# EAGLE design uPlaits_SE_Control_Board (EAGLE 9.6.2)
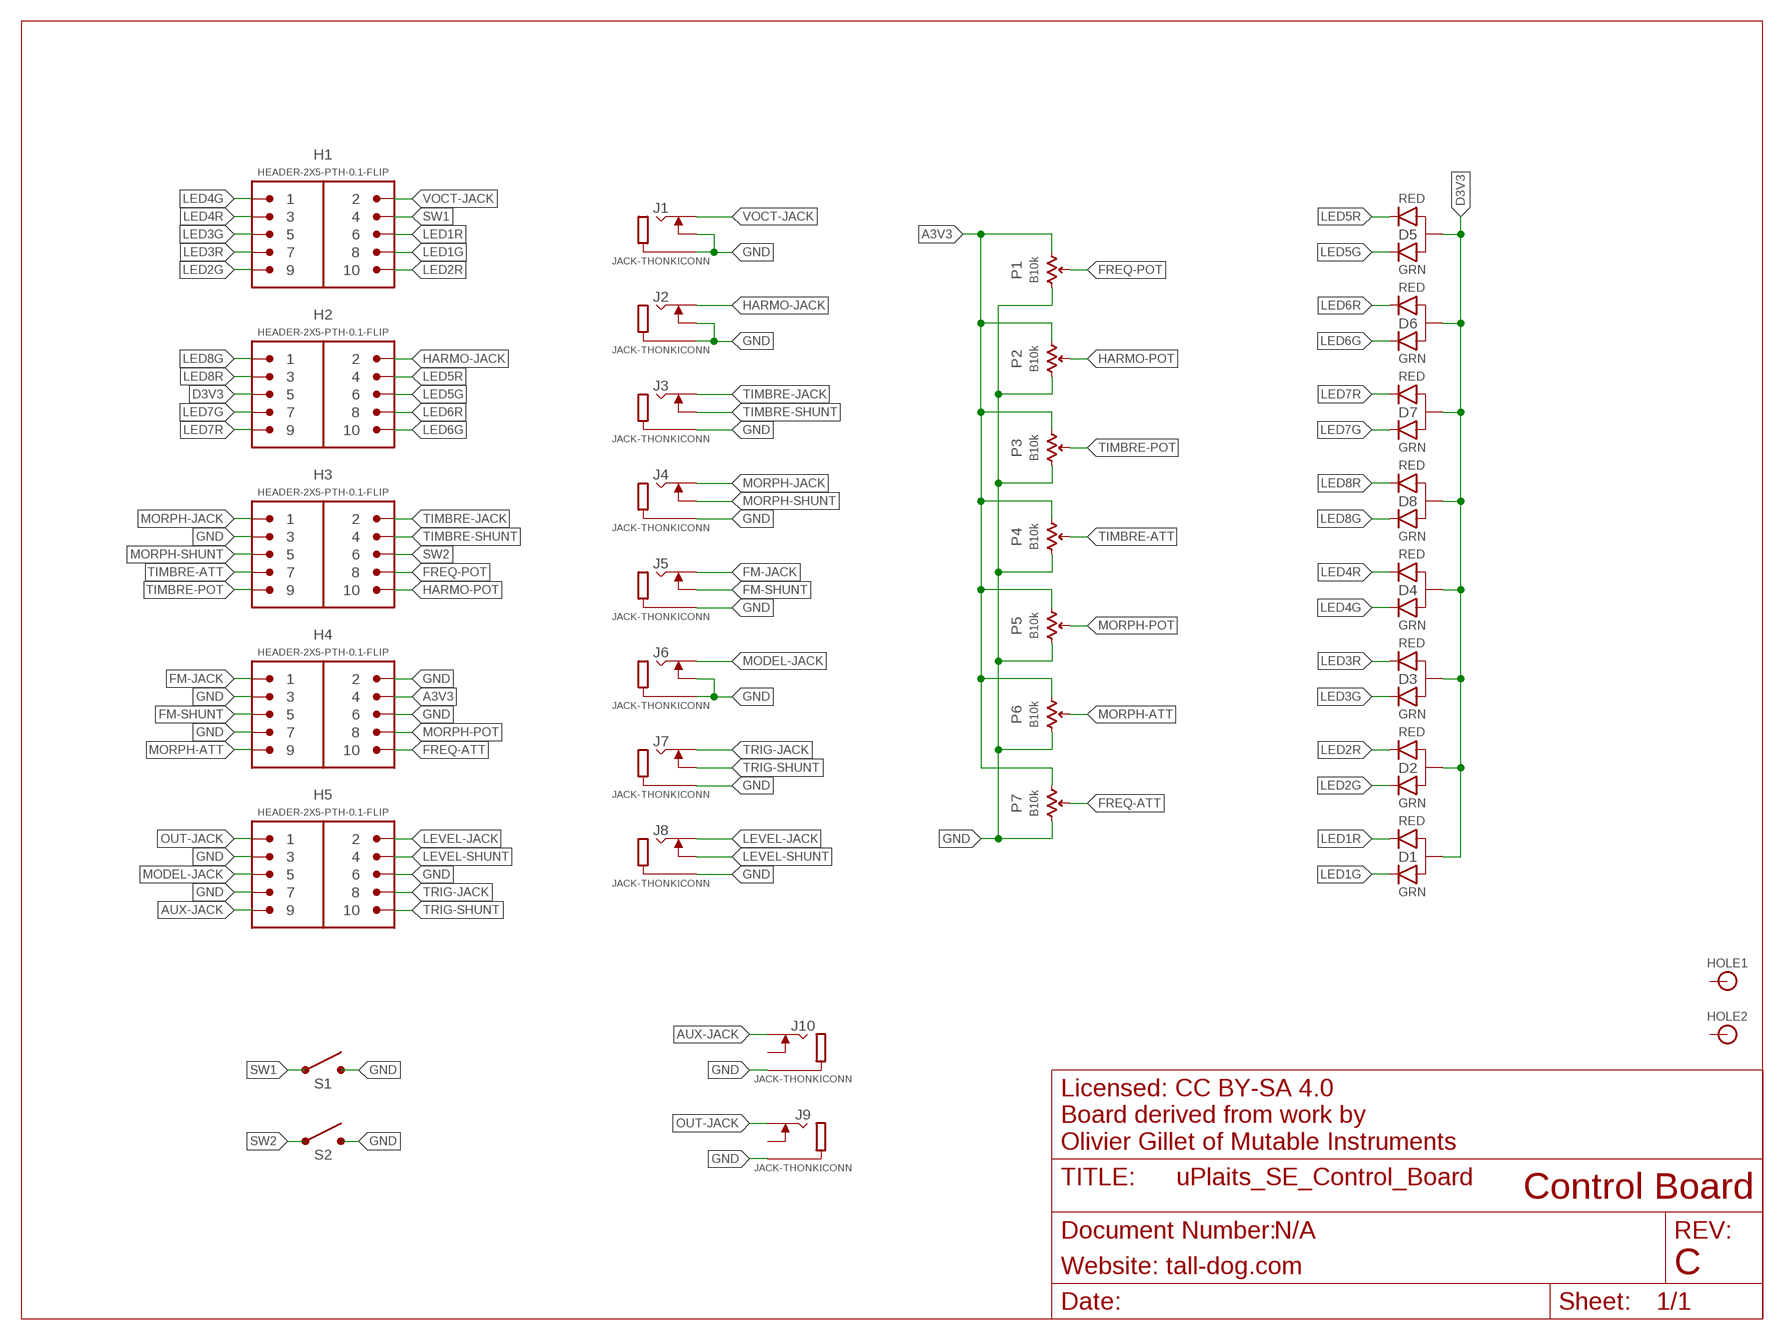
[diagram p0: schematic, sheet 1]

## Parts
D1  LED-DUAL-PTH  [LED-T1-3]
D2  LED-DUAL-PTH  [LED-T1-3]
D3  LED-DUAL-PTH  [LED-T1-3]
D4  LED-DUAL-PTH  [LED-T1-3]
D5  LED-DUAL-PTH  [LED-T1-3]
D6  LED-DUAL-PTH  [LED-T1-3]
D7  LED-DUAL-PTH  [LED-T1-3]
D8  LED-DUAL-PTH  [LED-T1-3]
H1  HEADER-2X5-PTH-0.1-FLIP  [PTH-0.1-2X5-FLIP]
H2  HEADER-2X5-PTH-0.1-FLIP  [PTH-0.1-2X5-FLIP]
H3  HEADER-2X5-PTH-0.1-FLIP  [PTH-0.1-2X5-FLIP]
H4  HEADER-2X5-PTH-0.1-FLIP  [PTH-0.1-2X5-FLIP]
H5  HEADER-2X5-PTH-0.1-FLIP  [PTH-0.1-2X5-FLIP]
HOLE1  HOLE  [HOLE-M2.5]
HOLE2  HOLE  [HOLE-M2.5]
J1  JACK-THONKICONN  [THONKICONN]
J2  JACK-THONKICONN  [THONKICONN]
J3  JACK-THONKICONN  [THONKICONN]
J4  JACK-THONKICONN  [THONKICONN]
J5  JACK-THONKICONN  [THONKICONN]
J6  JACK-THONKICONN  [THONKICONN]
J7  JACK-THONKICONN  [THONKICONN]
J8  JACK-THONKICONN  [THONKICONN]
J9  JACK-THONKICONN  [THONKICONN]
J10  JACK-THONKICONN  [THONKICONN]
P1  B10k  POT-ALPS-VERT-PS  [POT-SONG-9MM]
P2  B10k  POT-ALPS-VERT-PS  [POT-SONG-9MM]
P3  B10k  POT-ALPS-VERT-PS  [POT-SONG-9MM]
P4  B10k  POT-ALPS-VERT-PS  [POT-SONG-9MM]
P5  B10k  POT-ALPS-VERT-PS  [POT-SONG-9MM]
P6  B10k  POT-ALPS-VERT-PS  [POT-SONG-9MM]
P7  B10k  POT-ALPS-VERT-PS  [POT-SONG-9MM]
S1  SPST-PTH  [TL1105]
S2  SPST-PTH  [TL1105]

## Nets
A3V3: H4.4 P1.P$1(E) P2.P$1(E) P3.P$1(E) P4.P$1(E) P5.P$1(E) P6.P$1(E) P7.P$1(E)
AUX-JACK: H5.9 J10.P3
D3V3: D1.2(A) D2.2(A) D3.2(A) D4.2(A) D5.2(A) D6.2(A) D7.2(A) D8.2(A) H2.5
FM-JACK: H4.1 J5.P3
FM-SHUNT: H4.5 J5.P2
FREQ-ATT: H4.10 P7.P$2(S)
FREQ-POT: H3.8 P1.P$2(S)
GND: H3.3 H4.2 H4.3 H4.6 H4.7 H5.3 H5.6 H5.7 J1.P1 J1.P2 J2.P1 J2.P2 J3.P1 J4.P1 J5.P1 J6.P1 J6.P2 J7.P1 J8.P1 J9.P1 J10.P1 P1.P$3(A) P2.P$3(A) P3.P$3(A) P4.P$3(A) P5.P$3(A) P6.P$3(A) P7.P$3(A) S1.3 S1.4 S2.3 S2.4
HARMO-JACK: H2.2 J2.P3
HARMO-POT: H3.10 P2.P$2(S)
LED1G: D1.3(GRN) H1.8
LED1R: D1.1(RED) H1.6
LED2G: D2.3(GRN) H1.9
LED2R: D2.1(RED) H1.10
LED3G: D3.3(GRN) H1.5
LED3R: D3.1(RED) H1.7
LED4G: D4.3(GRN) H1.1
LED4R: D4.1(RED) H1.3
LED5G: D5.3(GRN) H2.6
LED5R: D5.1(RED) H2.4
LED6G: D6.3(GRN) H2.10
LED6R: D6.1(RED) H2.8
LED7G: D7.3(GRN) H2.7
LED7R: D7.1(RED) H2.9
LED8G: D8.3(GRN) H2.1
LED8R: D8.1(RED) H2.3
LEVEL-JACK: H5.2 J8.P3
LEVEL-SHUNT: H5.4 J8.P2
MODEL-JACK: H5.5 J6.P3
MORPH-ATT: H4.9 P6.P$2(S)
MORPH-JACK: H3.1 J4.P3
MORPH-POT: H4.8 P5.P$2(S)
MORPH-SHUNT: H3.5 J4.P2
OUT-JACK: H5.1 J9.P3
SW1: H1.4 S1.1 S1.2
SW2: H3.6 S2.1 S2.2
TIMBRE-ATT: H3.7 P4.P$2(S)
TIMBRE-JACK: H3.2 J3.P3
TIMBRE-POT: H3.9 P3.P$2(S)
TIMBRE-SHUNT: H3.4 J3.P2
TRIG-JACK: H5.8 J7.P3
TRIG-SHUNT: H5.10 J7.P2
VOCT-JACK: H1.2 J1.P3
Unconnected: HOLE1.P$1 HOLE1.P$2 HOLE1.P$3 HOLE1.P$4 HOLE1.P$5 HOLE1.P$6 HOLE1.P$7 HOLE1.P$8 HOLE1.P$9 HOLE2.P$1 HOLE2.P$2 HOLE2.P$3 HOLE2.P$4 HOLE2.P$5 HOLE2.P$6 HOLE2.P$7 HOLE2.P$8 HOLE2.P$9 J9.P2 J10.P2

## Notes on the sheet
- Licensed: CC BY-SA 4.0
  Board derived from work by
  Olivier Gillet of Mutable Instruments
- Control Board
- N/A
- Website: tall-dog.com | C

## Library data of the parts
D1-D8 = uPlaits_SE_Library:LED-DUAL
H1-H5 = uPlaits_SE_Library:HEADER-2X5
HOLE1 HOLE2 = uPlaits_SE_Library:HOLE
J1-J10 = uPlaits_SE_Library:JACK
P1-P7 = uPlaits_SE_Library:POT
S1 S2 = uPlaits_SE_Library:SPST

## Board
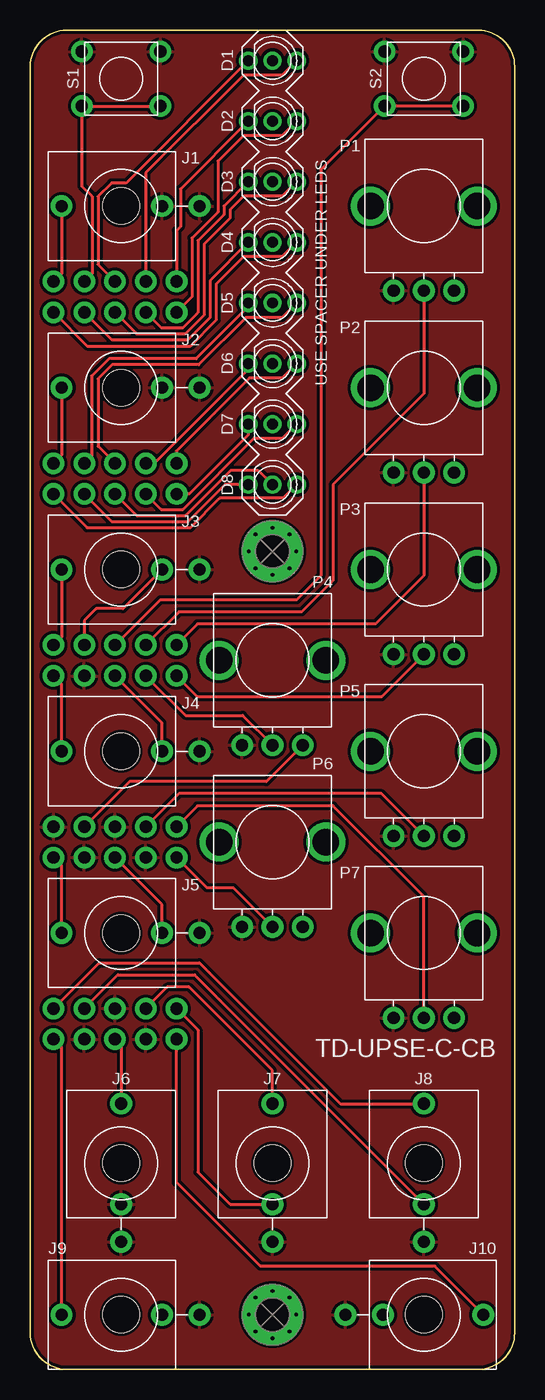
[diagram p1: board, top side]
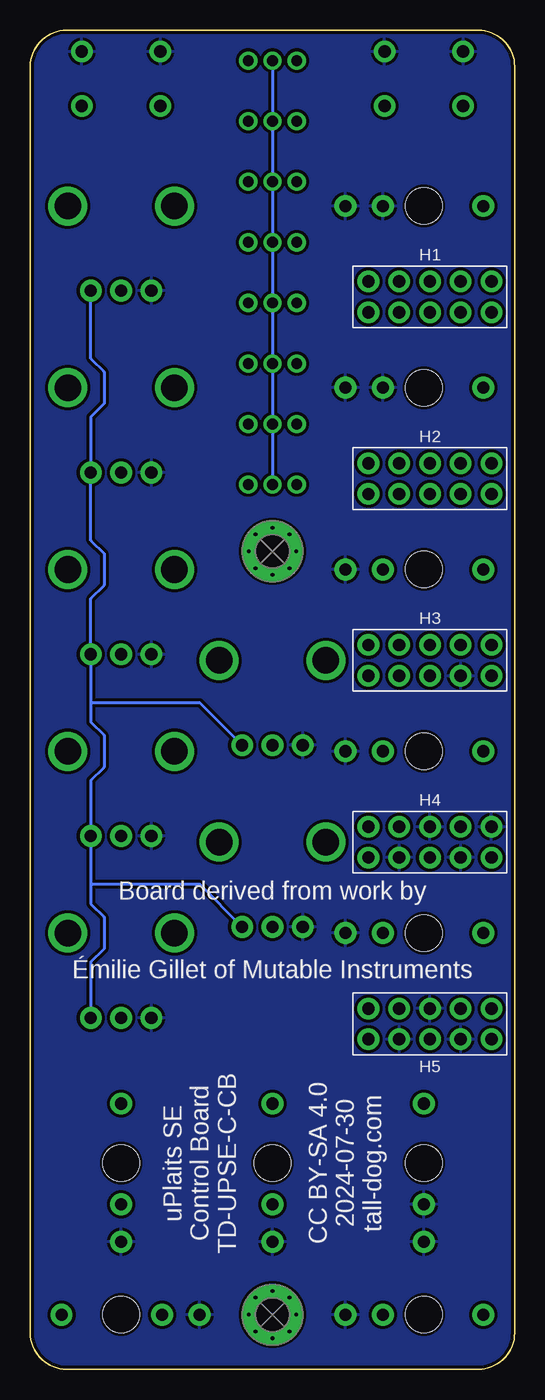
[diagram p2: board, bottom side, seen from below]

Size 40 x 110.5 mm. Coordinates in mm from the lower left corner, seen from the top.
Outline: 3,0 37,0 arc90 40,3 40,107.5 arc90 37,110.5 3,110.5 arc90 0,107.5 0,3 arc90 3,0
Copper layers (1*16): Top 0.035mm / dielectric 1.5mm / Bottom 0.035mm
Design rules "default *": minimum track width 0.25mm, minimum drill 0.3mm, track to track 0.25mm, track to pad 0.25mm, pad to pad 0.25mm, via to via 0.25mm, smd to smd 0.25mm, copper to edge 0.25mm, drill to drill 0.25mm, minimum pad ring 10mil, minimum via ring 8mil, stop-mask expansion 0mil, vias tented up to drill 0mil, thermal gap 0.25mm

### Footprints (pad centres in the part's own frame; a part is rotated, then mirrored left to right if it is on the bottom)
LED-T1-3 = drill 0.9 pad 1.5: 1 -2,0; 2 0,0; 3 2,0
PTH-0.1-2X5-FLIP = drill 1.016 pad 1.778: 1 -5.08,-1.27; 2 -5.08,1.27; 3 -2.54,-1.27; 4 -2.54,1.27; 5 0,-1.27; 6 0,1.27; 7 2.54,-1.27; 8 2.54,1.27; 9 5.08,-1.27; 10 5.08,1.27
HOLE-M2.5 = drill 2.75 pad 5: P$1 0,0 | drill 0.3: P$2 0,1.95; P$3 0,-1.95; P$4 -1.95,0; P$5 1.95,0; P$6 1.4,1.4; P$7 -1.4,1.4; P$8 -1.4,-1.4; P$9 1.4,-1.4
THONKICONN = drill 1 pad 1.8: P1 0,-6.48; P2 0,-3.38; P3 0,4.92 | hole 3: 0,0
POT-SONG-9MM = drill 1 pad 1.8: P$1 -2.5,7; P$2 0,7; P$3 2.5,7 | drill 2.2 pad 2.8: P$4 -4.4,0; P$5 4.4,0
TL1105 = drill 1.016 pad 1.778: 1 -3.25,-2.25; 2 3.25,-2.25; 3 -3.25,2.25; 4 3.25,2.25

### Placement (x,y rotation side)
D1  20,108 0 top
D2  20,103 0 top
D3  20,98 0 top
D4  20,93 0 top
D5  20,88 0 top
D6  20,83 0 top
D7  20,78 0 top
D8  20,73 0 top
H1  7,88.5 0 top
H2  7,73.5 0 top
H3  7,58.5 0 top
H4  7,43.5 0 top
H5  7,28.5 0 top
HOLE1  20,4.5 0 top
HOLE2  20,67.5 0 top
J1  7.5,96 90 top
J2  7.5,81 90 top
J3  7.5,66 90 top
J4  7.5,51 90 top
J5  7.5,36 90 top
J6  7.5,17 0 top
J7  20,17 0 top
J8  32.5,17 0 top
J9  7.5,4.5 90 top
J10  32.5,4.5 270 top
P1  32.5,96 180 top
P2  32.5,81 180 top
P3  32.5,66 180 top
P4  20,58.5 180 top
P5  32.5,51 180 top
P6  20,43.5 180 top
P7  32.5,36 180 top
S1  7.5,106.5 0 top
S2  32.5,106.5 0 top
U$1  [LED-SPACER]  20,90.5 0 top

### Tracks (layer width: path | path; a pad name or v marks a point on that pad's centre or on a via)
A3V3
  Top 0.25: P4.P$1 19.5,48.5 8.19,48.5 H4.4
  Bottom 0.25: 35,55 P3.P$1 35,63.6 33.92,64.68 33.92,67.32 35,68.4 P2.P$1 35,78.6 33.92,79.68 33.92,82.32 35,83.4 P1.P$1 | P5.P$1 35,40 26,40 P6.P$1 | P4.P$1 26,55 35,55 | 35,55 35,53.4 33.92,52.32 33.92,49.68 35,48.6 P5.P$1 | P5.P$1 35,38.4 33.92,37.32 33.92,34.68 35,33.6 P7.P$1
AUX-JACK
  Top 0.25: J10.P3 33.42,8.5 19,8.5 12.08,15.42 H5.9
D3V3
  Top 0.25: D8.2 18.8,74.2 16.56,74.2 12.81,70.45 8.78,70.45 H2.5
  Bottom 0.25: D1.2 D2.2 D3.2 D4.2 D5.2 D6.2 D7.2 D8.2
FM-JACK
  Top 0.25: J5.P3 2.58,41.57 H4.1
FM-SHUNT
  Top 0.25: J5.P2 10.88,38.35 H4.5
FREQ-ATT
  Top 0.25: P7.P$2 32.5,39 25,46.5 13.81,46.5 H4.10
FREQ-POT
  Top 0.25: H3.8 12.27,62.5 22.41,62.5 25,65.09 25,73 32.5,80.5 P1.P$2
GND
  pour Top: 0,110.5 40,110.5 40,0 0,0
  pour Bottom: 0,110.5 40,110.5 40,0 0,0
HARMO-JACK
  Top 0.25: J2.P3 2.58,75.43 H2.2
HARMO-POT
  Top 0.25: H3.10 13.81,61.5 28.5,61.5 32.5,65.5 P2.P$2
LED1G
  Top 0.25: D1.3 20.8,106.8 17.6,106.8 9.54,98.74 H1.8
LED1R
  Top 0.25: D1.1 7.9,97.9 6.7,97.9 5.6,96.8 5.6,91.17 H1.6
LED2G
  Top 0.25: D2.3 20.8,101.8 17.6,101.8 15.5,99.7 15.5,95.5 13.36,93.36 13.36,88.5 H1.9
LED2R
  Top 0.25: D2.1 12.4,97.4 12.4,94.29 12.08,93.97 H1.10
LED3G
  Top 0.25: D3.3 20.8,96.8 17.6,96.8 16.5,95.7 16.5,95 14.36,92.86 14.36,87 12.81,85.45 8.78,85.45 H1.5
LED3R
  Top 0.25: D3.1 16,96 16,95.29 13.86,93.15 13.86,87.2 12.61,85.95 10.81,85.95 H1.7
LED4G
  Top 0.25: D4.3 20.8,91.8 17.6,91.8 15.36,89.56 15.36,86.58 13.23,84.45 4.7,84.45 H1.1
LED4R
  Top 0.25: D4.1 14.86,89.86 14.86,86.79 13.02,84.95 6.74,84.95 H1.3
LED5G
  Top 0.25: D5.3 20.8,86.8 17.81,86.8 13.91,82.9 6.75,82.9 5.6,81.75 5.6,76.17 H2.6
LED5R
  Top 0.25: D5.1 18,87.7 13.7,83.4 6.5,83.4 5.06,81.96 5.06,75.37 H2.4
LED6G
  Top 0.25: D6.3 20.8,81.8 18.1,81.8 12.08,75.78 H2.10
LED6R
  Top 0.25: D6.1 18,82.5 10.27,74.77 H2.8
LED7G
  Top 0.25: D7.3 20.8,76.8 18.45,76.8 12.61,70.95 10.81,70.95 H2.7
LED7R
  Top 0.25: D7.1 18,77.1 13.13,72.23 H2.9
LED8G
  Top 0.25: D8.3 20.87,71.88 15.65,71.88 13.23,69.45 4.7,69.45 H2.1
LED8R
  Top 0.25: D8.1 16.07,73 13.02,69.95 6.74,69.95 H2.3
LEVEL-JACK
  Top 0.25: J8.P3 25.6,21.92 13.97,33.55 5.7,33.55 H5.2
LEVEL-SHUNT
  Top 0.25: J8.P2 13.57,32.55 7.24,32.55 H5.4
MODEL-JACK
  Top 0.25: H5.5 7.5,26.73 J6.P3
MORPH-ATT
  Top 0.25: P6.P$2 16.75,39.75 14.56,39.75 H4.9
MORPH-JACK
  Top 0.25: J4.P3 2.58,56.57 H3.1
MORPH-POT
  Top 0.25: P5.P$2 29,47.5 12.27,47.5 H4.8
MORPH-SHUNT
  Top 0.25: J4.P2 10.88,53.35 H3.5
OUT-JACK
  Top 0.25: J9.P3 2.58,26.57 H5.1
SW1
  Top 0.25: H1.4 5.1,90.41 5.1,96.8 4.25,97.65 S1.1 S1.2
SW2
  Top 0.25: S2.2 S2.1 24,99 24,65.5 22,63.5 10.73,63.5 H3.6
TIMBRE-ATT
  Top 0.25: P4.P$2 17.55,53.95 12.81,53.95 H3.7
TIMBRE-JACK
  Top 0.25: J3.P3 2.58,60.43 H3.2
TIMBRE-POT
  Top 0.25: P3.P$2 29.02,55.52 13.79,55.52 H3.9
TIMBRE-SHUNT
  Top 0.25: J3.P2 7.65,62.77 5.46,62.77 4.46,61.77 H3.4
TRIG-JACK
  Top 0.25: H5.8 11.31,31.55 13.11,31.55 20,24.65 J7.P3
TRIG-SHUNT
  Top 0.25: J7.P2 16.5,13.62 13.86,16.27 13.86,28 H5.10
VOCT-JACK
  Top 0.25: J1.P3 2.58,90.43 H1.2

### Text on the board
tPlace: TD-UPSE-C-CB
bPlace: Board derived from work by | Émilie Gillet of Mutable Instruments | CC BY-SA 4.0 / 2024-07-30 / tall-dog.com | uPlaits SE / Control Board / TD-UPSE-C-CB